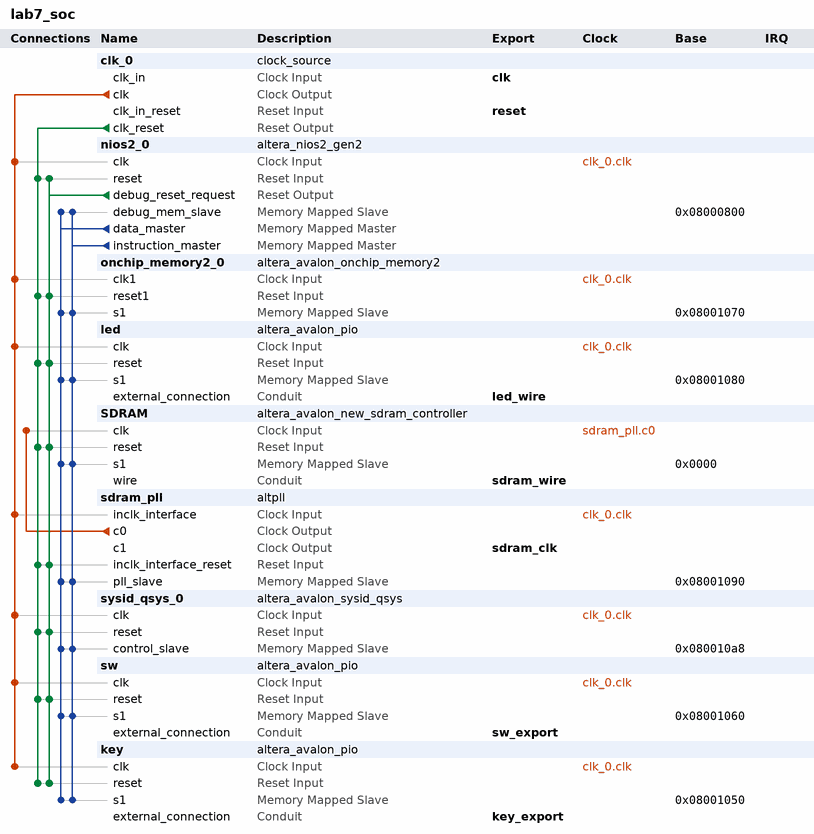
[diagram p0: system contents]
# Platform Designer (Qsys) system lab7_soc, Cyclone IV E EP4CE115F29C7
# Parameters at their usual value, and those the tool derives, are not listed.
package require -exact qsys 20.1
create_system lab7_soc
set_project_property DEVICE_FAMILY {Cyclone IV E}
set_project_property DEVICE EP4CE115F29C7

add_instance clk_0 clock_source 20.1
set_instance_parameter_value clk_0 clockFrequency 50000000

add_instance nios2_0 altera_nios2_gen2 20.1
set_instance_parameter_value nios2_0 dcache_size 2048
set_instance_parameter_value nios2_0 exceptionSlave SDRAM.s1
set_instance_parameter_value nios2_0 icache_size 4096
set_instance_parameter_value nios2_0 impl Tiny
set_instance_parameter_value nios2_0 resetSlave SDRAM.s1

add_instance onchip_memory2_0 altera_avalon_onchip_memory2 20.1
set_instance_parameter_value onchip_memory2_0 dataWidth 32
set_instance_parameter_value onchip_memory2_0 dualPort false
set_instance_parameter_value onchip_memory2_0 initMemContent true
set_instance_parameter_value onchip_memory2_0 initializationFileName onchip_mem.hex
set_instance_parameter_value onchip_memory2_0 memorySize 16

add_instance led altera_avalon_pio 20.1
set_instance_parameter_value led direction Output
set_instance_parameter_value led width 8

add_instance SDRAM altera_avalon_new_sdram_controller 20.1
set_instance_parameter_value SDRAM TAC 5.5
set_instance_parameter_value SDRAM TRCD 20.0
set_instance_parameter_value SDRAM TRP 20.0
set_instance_parameter_value SDRAM casLatency 3
set_instance_parameter_value SDRAM columnWidth 10
set_instance_parameter_value SDRAM dataWidth 32
set_instance_parameter_value SDRAM generateSimulationModel false
set_instance_parameter_value SDRAM model single_Micron_MT48LC4M32B2_7_chip
set_instance_parameter_value SDRAM numberOfBanks 4
set_instance_parameter_value SDRAM numberOfChipSelects 1
set_instance_parameter_value SDRAM powerUpDelay 200.0
set_instance_parameter_value SDRAM refreshPeriod 7.8125
set_instance_parameter_value SDRAM rowWidth 13

add_instance sdram_pll altpll 20.1
set_instance_parameter_value sdram_pll CLK0_DIVIDE_BY 1
set_instance_parameter_value sdram_pll CLK0_MULTIPLY_BY 1
set_instance_parameter_value sdram_pll CLK1_DIVIDE_BY 1
set_instance_parameter_value sdram_pll CLK1_DUTY_CYCLE 50
set_instance_parameter_value sdram_pll CLK1_MULTIPLY_BY 1
set_instance_parameter_value sdram_pll CLK1_PHASE_SHIFT -3000
set_instance_parameter_value sdram_pll INCLK0_INPUT_FREQUENCY 20000
set_instance_parameter_value sdram_pll PORT_ARESET PORT_UNUSED
set_instance_parameter_value sdram_pll PORT_LOCKED PORT_UNUSED
set_instance_parameter_value sdram_pll PORT_clk1 PORT_USED
set_instance_parameter_value sdram_pll PORT_clk2 PORT_UNUSED
set_instance_parameter_value sdram_pll PORT_clk3 PORT_UNUSED

add_instance sysid_qsys_0 altera_avalon_sysid_qsys 20.1
set_instance_parameter_value sysid_qsys_0 id 0

add_instance sw altera_avalon_pio 20.1
set_instance_parameter_value sw direction Input
set_instance_parameter_value sw width 8

add_instance key altera_avalon_pio 20.1
set_instance_parameter_value key direction Input
set_instance_parameter_value key width 2

# connections
add_connection clk_0.clk key.clk clock
add_connection clk_0.clk led.clk clock
add_connection clk_0.clk nios2_0.clk clock
add_connection clk_0.clk onchip_memory2_0.clk1 clock
add_connection clk_0.clk sdram_pll.inclk_interface clock
add_connection clk_0.clk sw.clk clock
add_connection clk_0.clk sysid_qsys_0.clk clock
add_connection sdram_pll.c0 SDRAM.clk clock
add_connection clk_0.clk_reset key.reset reset
add_connection clk_0.clk_reset led.reset reset
add_connection clk_0.clk_reset nios2_0.reset reset
add_connection clk_0.clk_reset onchip_memory2_0.reset1 reset
add_connection clk_0.clk_reset SDRAM.reset reset
add_connection clk_0.clk_reset sdram_pll.inclk_interface_reset reset
add_connection clk_0.clk_reset sw.reset reset
add_connection clk_0.clk_reset sysid_qsys_0.reset reset
add_connection nios2_0.debug_reset_request key.reset reset
add_connection nios2_0.debug_reset_request led.reset reset
add_connection nios2_0.debug_reset_request nios2_0.reset reset
add_connection nios2_0.debug_reset_request onchip_memory2_0.reset1 reset
add_connection nios2_0.debug_reset_request SDRAM.reset reset
add_connection nios2_0.debug_reset_request sdram_pll.inclk_interface_reset reset
add_connection nios2_0.debug_reset_request sw.reset reset
add_connection nios2_0.debug_reset_request sysid_qsys_0.reset reset
add_connection nios2_0.data_master key.s1 avalon
set_connection_parameter_value nios2_0.data_master/key.s1 baseAddress 0x08001050
add_connection nios2_0.data_master led.s1 avalon
set_connection_parameter_value nios2_0.data_master/led.s1 baseAddress 0x08001080
add_connection nios2_0.data_master nios2_0.debug_mem_slave avalon
set_connection_parameter_value nios2_0.data_master/nios2_0.debug_mem_slave baseAddress 0x08000800
add_connection nios2_0.data_master onchip_memory2_0.s1 avalon
set_connection_parameter_value nios2_0.data_master/onchip_memory2_0.s1 baseAddress 0x08001070
add_connection nios2_0.data_master SDRAM.s1 avalon
set_connection_parameter_value nios2_0.data_master/SDRAM.s1 baseAddress 0x0000
add_connection nios2_0.data_master sdram_pll.pll_slave avalon
set_connection_parameter_value nios2_0.data_master/sdram_pll.pll_slave baseAddress 0x08001090
add_connection nios2_0.data_master sw.s1 avalon
set_connection_parameter_value nios2_0.data_master/sw.s1 baseAddress 0x08001060
add_connection nios2_0.data_master sysid_qsys_0.control_slave avalon
set_connection_parameter_value nios2_0.data_master/sysid_qsys_0.control_slave baseAddress 0x080010a8
add_connection nios2_0.instruction_master key.s1 avalon
set_connection_parameter_value nios2_0.instruction_master/key.s1 baseAddress 0x08001050
add_connection nios2_0.instruction_master led.s1 avalon
set_connection_parameter_value nios2_0.instruction_master/led.s1 baseAddress 0x08001080
add_connection nios2_0.instruction_master nios2_0.debug_mem_slave avalon
set_connection_parameter_value nios2_0.instruction_master/nios2_0.debug_mem_slave baseAddress 0x08000800
add_connection nios2_0.instruction_master onchip_memory2_0.s1 avalon
set_connection_parameter_value nios2_0.instruction_master/onchip_memory2_0.s1 baseAddress 0x08001070
add_connection nios2_0.instruction_master SDRAM.s1 avalon
set_connection_parameter_value nios2_0.instruction_master/SDRAM.s1 baseAddress 0x0000
add_connection nios2_0.instruction_master sdram_pll.pll_slave avalon
set_connection_parameter_value nios2_0.instruction_master/sdram_pll.pll_slave baseAddress 0x08001090
add_connection nios2_0.instruction_master sw.s1 avalon
set_connection_parameter_value nios2_0.instruction_master/sw.s1 baseAddress 0x08001060
add_connection nios2_0.instruction_master sysid_qsys_0.control_slave avalon
set_connection_parameter_value nios2_0.instruction_master/sysid_qsys_0.control_slave baseAddress 0x080010a8

# exported interfaces
add_interface clk clock sink
set_interface_property clk EXPORT_OF clk_0.clk_in
add_interface key_export conduit end
set_interface_property key_export EXPORT_OF key.external_connection
add_interface led_wire conduit end
set_interface_property led_wire EXPORT_OF led.external_connection
add_interface reset reset sink
set_interface_property reset EXPORT_OF clk_0.clk_in_reset
add_interface sdram_clk clock source
set_interface_property sdram_clk EXPORT_OF sdram_pll.c1
add_interface sdram_wire conduit end
set_interface_property sdram_wire EXPORT_OF SDRAM.wire
add_interface sw_export conduit end
set_interface_property sw_export EXPORT_OF sw.external_connection

set_interconnect_requirement {$system} qsys_mm.clockCrossingAdapter HANDSHAKE
set_interconnect_requirement {$system} qsys_mm.enableEccProtection FALSE
set_interconnect_requirement {$system} qsys_mm.insertDefaultSlave FALSE
set_interconnect_requirement {$system} qsys_mm.maxAdditionalLatency 1

save_system lab7_soc.qsys
